# EAGLE design -6V (EAGLE 6.5.0)
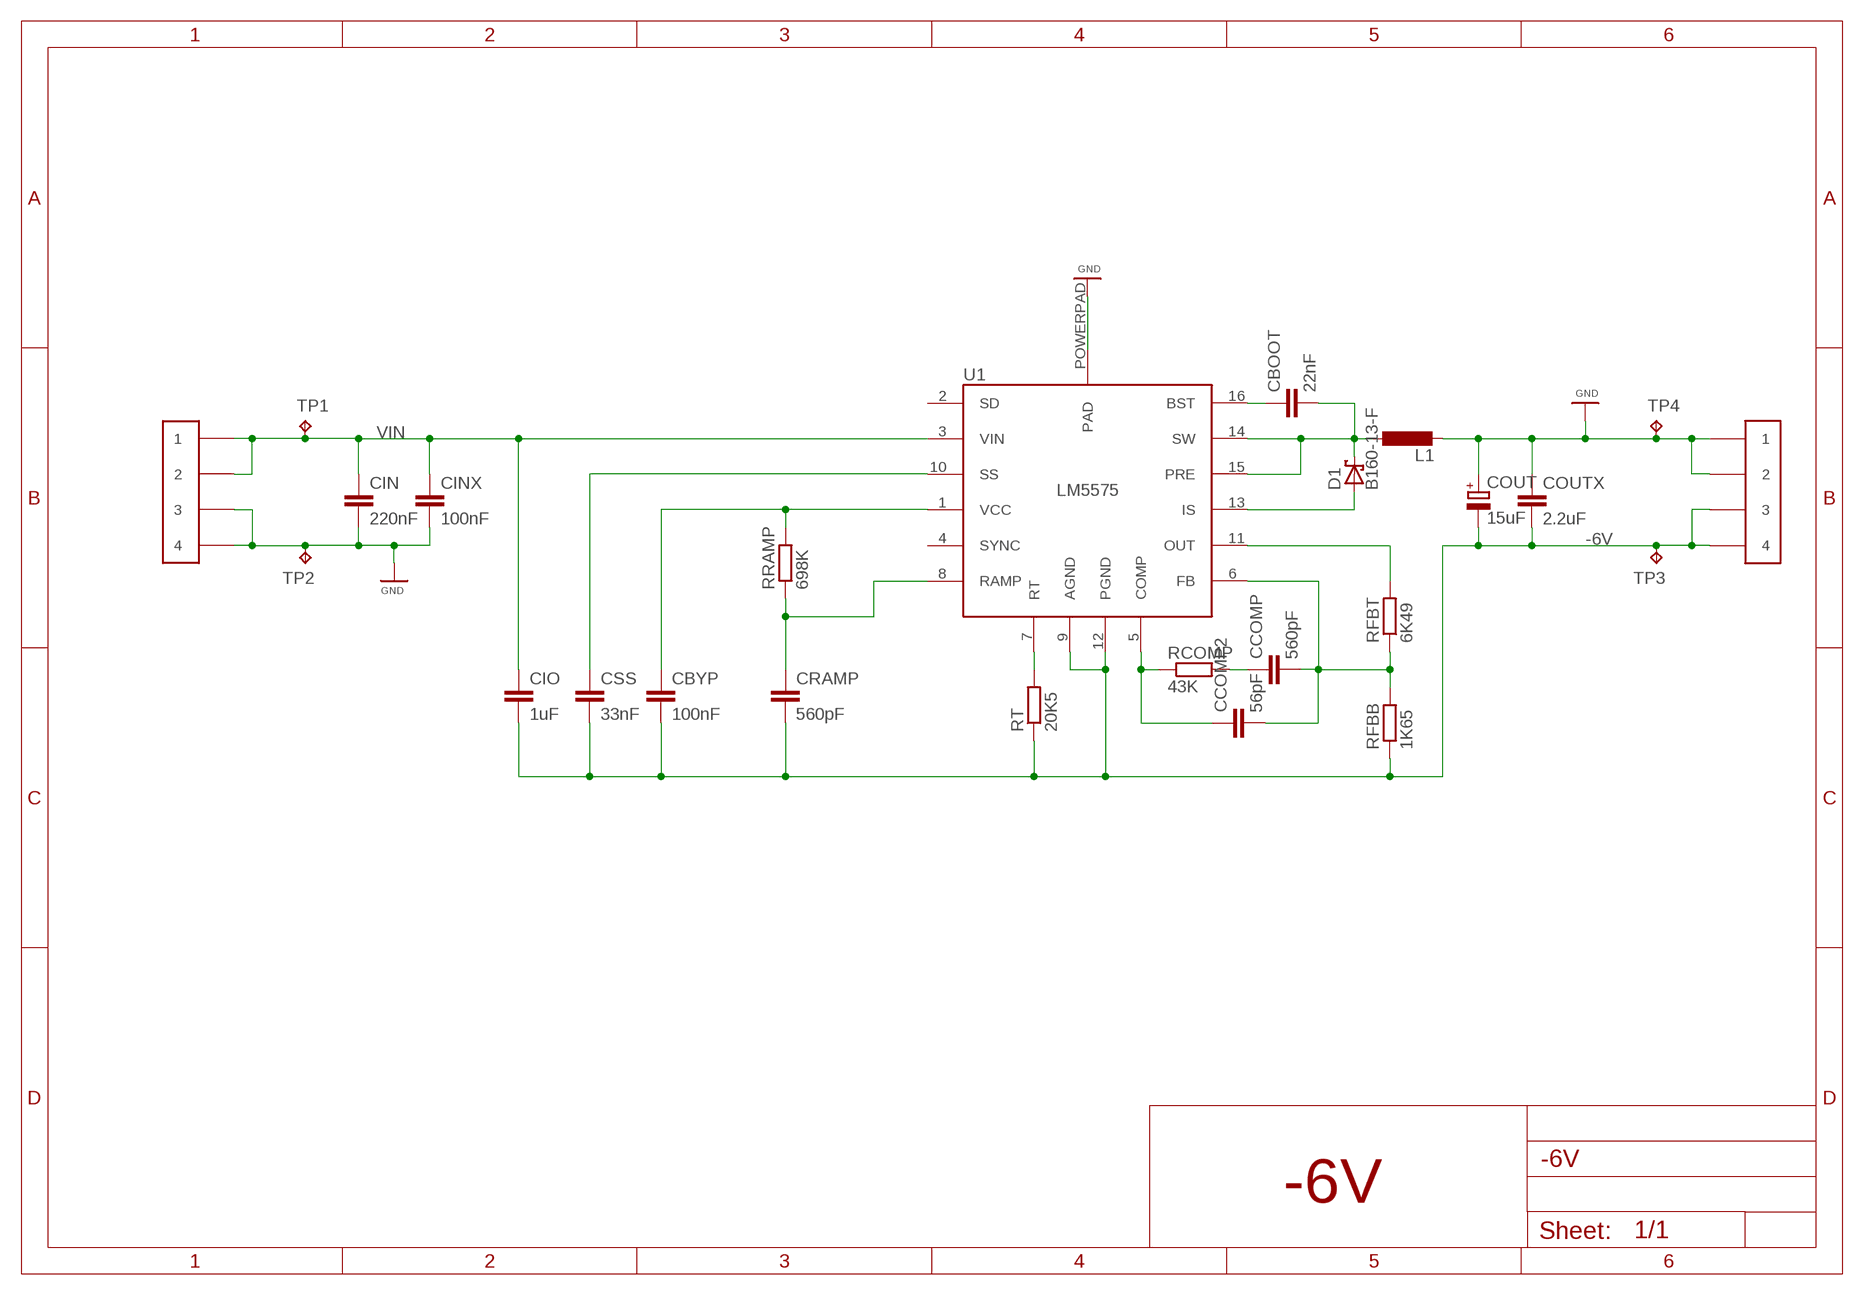
[diagram p0: schematic, sheet 1]
FRAME1 (FRAME): EXCLUDE_FROM_BOM: YES

## Parts
CBOOT  22nF  C0603  [C0603]
CBYP  100nF  C0603  [C0603]
CCOMP  560pF  C0603  [C0603]
CCOMP2  56pF  C0603  [C0603]
CIN  220nF  C0805  [C0805]
CINX  100nF  C0805  [C0805]
CIO  1uF  C1206  [C1206]
COUT  15uF  CPOLKEMET_EDK_5MM  [KEMET_EDK_5MM]
COUTX  2.2uF  C0603  [C0603]
CRAMP  560pF  C0603  [C0603]
CSS  33nF  C0603  [C0603]
D1  B160-13-F  [SMA]
L1  LSDR1006  [BOURNS-SDR1006]
RCOMP  43K  R0603  [R0603]
RFBB  1K65  R0603  [R0603]
RFBT  6K49  R0603  [R0603]
RRAMP  698K  R0603  [R0603]
RT  20K5  R0603  [R0603]
TP1  TP  [TESTPAD]
TP2  TP  [TESTPAD]
TP3  TP  [TESTPAD]
TP4  TP  [TESTPAD]
U1  LM5575  [HTSSOP16]
X1  PINCON-1X4  [PINCON-1X4]
X2  PINCON-1X4  [PINCON-1X4]

## Nets
-6V: CBYP.2 CIO.2 COUT.M(-) COUTX.2 CRAMP.2 CSS.2 RFBB.1 RT.1 TP3.P$1(TP) U1.9(AGND) U1.12(PGND) X2.P$3 X2.P$4
GND: CIN.2 CINX.2 COUT.P(+) COUTX.1 L1.2 TP2.P$1(TP) TP4.P$1(TP) U1.POWERPAD(PAD) X1.P$3 X1.P$4 X2.P$1 X2.P$2
N$2: CSS.1 U1.10(SS)
N$3: CBYP.1 RRAMP.2 U1.1(VCC)
N$4: CRAMP.1 RRAMP.1 U1.8(RAMP)
N$5: RT.2 U1.7(RT)
N$7: CCOMP2.1 RCOMP.1 U1.5(COMP)
N$8: CCOMP.1 RCOMP.2
N$9: CCOMP2.2 CCOMP.2 RFBB.2 RFBT.1 U1.6(FB)
N$10: RFBT.2 U1.11(OUT)
N$11: D1.A U1.13(IS)
N$12: CBOOT.2 D1.C L1.1 U1.14(SW) U1.15(PRE)
N$13: CBOOT.1 U1.16(BST)
VIN: CIN.1 CINX.1 CIO.1 TP1.P$1(TP) U1.3(VIN) X1.P$1 X1.P$2
Unconnected: U1.2(SD) U1.4(SYNC)

## Notes on the sheet
- -6V

## Library data of the parts
CBOOT CBYP CCOMP CCOMP2 CIN CINX CRAMP CSS = plr_rcl:C
CIO = plr_rcl:C; MANUFACTURER: TDK; MPN: C3216X7R1H105K; OC_DIGIKEY: 445-1423-1-ND; OC_FARNELL: 1907358; OC_MOUSER: 810-C3216X7R1H105K
COUT = plr_rcl:CPOL; MANUFACTURER: Panasonic; MPN: 10SVP15M; OC_DIGIKEY: P16431CT-ND; OC_FARNELL: 9188886; OC_MOUSER: 667-10SVP15M
COUTX = plr_rcl:C; MANUFACTURER: Murata; MPN: GRM188R61A225KE34D; OC_DIGIKEY: 490-1545-1-ND; OC_FARNELL: 1828799; OC_MOUSER: 81-GRM188R61A225KE34
D1 = plr_diodes:B160-13-F; MANUFACTURER: DIODES INC; MPN: B160-13-F; OC_DIGIKEY: B160-FDICT-ND; OC_FARNELL: 1843674; OC_MOUSER: 621-B160-F
L1 = plr_rcl:L; MANUFACTURER: Bourns; MPN: SDR1006-560KL; OC_DIGIKEY: SDR1006-560KLCT-ND; OC_FARNELL: 2309276; OC_MOUSER: 652-SDR1006-560KL
RCOMP RFBB RFBT RRAMP RT = plr_rcl:R
TP1-TP4 = plr_common:TP; EXCLUDE_FROM_BOM: YES
U1 = plr_vreg:LM5575; MANUFACTURER: TI; MPN: LM5575MH/NOPB; OC_DIGIKEY: LM5575MH/NOPB-ND; OC_FARNELL: 1325420; OC_MOUSER: 926-LM5575MH/NOPB
X1 X2 = plc_con:PINCON-1X4

## Board
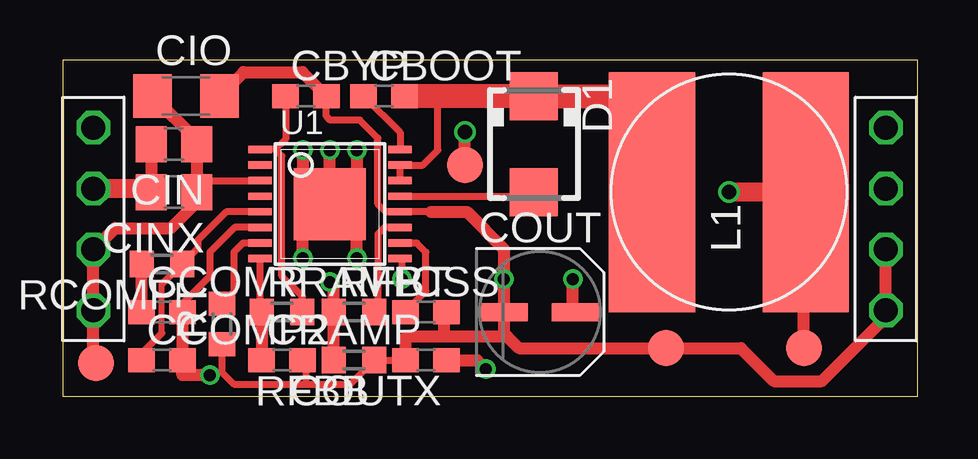
[diagram p1: board, top side]
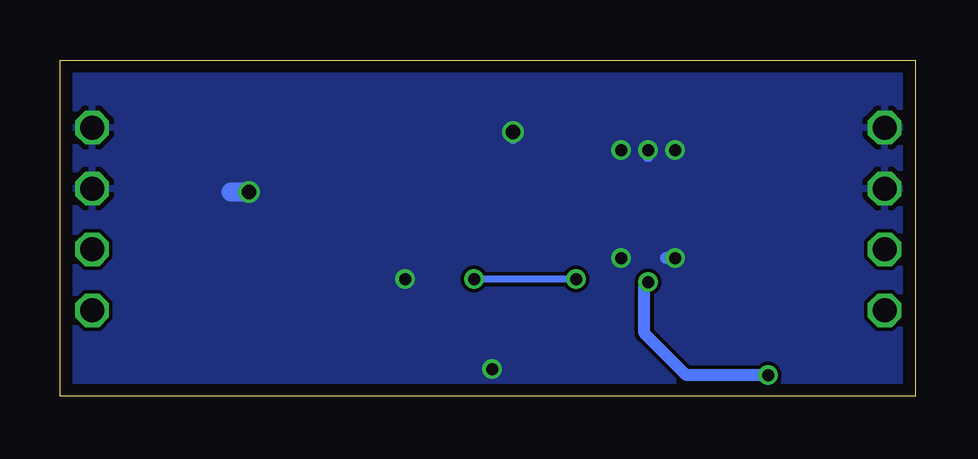
[diagram p2: board, bottom side, seen from below]

Size 35.62 x 14 mm. Coordinates in mm from the lower left corner, seen from the top.
Outline: 0,0 35.62,0 35.62,14 0,14 0,0
Copper layers (1*16): Top 0.035mm / dielectric 1.5mm / Bottom 0.035mm
Design rules "multi-cb_035um-cu_en *": minimum track width 6mil, minimum drill 12mil, track to track 6mil, track to pad 6mil, pad to pad 6mil, via to via 6mil, smd to smd 6mil, copper to edge 20mil, drill to drill 8mil, minimum pad ring 8mil, minimum via ring 6mil, stop-mask expansion 3mil, vias tented up to drill 0mil, thermal gap 8mil

### Footprints (pad centres in the part's own frame; a part is rotated, then mirrored left to right if it is on the bottom)
C0603 = smd 1.1 x 1: 1 -0.85,0; 2 0.85,0
C0805 = smd 1.3 x 1.5: 1 -0.95,0; 2 0.95,0
C1206 = smd 1.6 x 1.8: 1 -1.4,0; 2 1.4,0
KEMET_EDK_5MM = smd 2 x 0.75: M -1.5,0; P 1.5,0
SMA = smd 2 x 2: A 2,0; C -2,0
BOURNS-SDR1006 = smd 10 x 3.6: 1 0,3.2; 2 0,-3.2
R0603 = smd 1 x 1.1: 1 -0.85,0; 2 0.85,0
TESTPAD = smd 1.5 x 1.5: P$1 0,0
HTSSOP16 = smd 0.305 x 0.991: 1 -2.275,-2.918; 2 -1.625,-2.918; 3 -0.975,-2.918; 4 -0.325,-2.918; 5 0.325,-2.918; 6 0.975,-2.918; 7 1.625,-2.918; 8 2.275,-2.918; 9 2.275,2.918; 10 1.625,2.918; 11 0.975,2.918; 12 0.325,2.918; 13 -0.325,2.918; 14 -0.975,2.918; 15 -1.625,2.918; 16 -2.275,2.918 | smd 3 x 3: POWERPAD 0,0
PINCON-1X4 = drill 1 octagon: P$1 -3.81,0; P$2 -1.27,0; P$3 1.27,0; P$4 3.81,0

### Placement (x,y rotation side)
CBOOT  13.38,12.5 0 top
CBYP  10.12,12.5 0 top
CCOMP  4.12,3.5 0 top
CCOMP2  4.12,1.5 0 top
CIN  4.62,10.5 180 top
CINX  4.62,8.5 180 top
CIO  5.12,12.5 0 top
COUT  19.88,3.5 0 top
COUTX  15.12,1.5 180 top
CRAMP  9.12,1.5 0 top
CSS  15.12,3.5 0 top
D1  19.62,10.5 270 top
L1  27.75,8.5 90 top
RCOMP  4.12,5.5 180 top
RFBB  12.12,1.5 180 top
RFBT  12.12,3.5 0 top
RRAMP  9.12,3.5 0 top
RT  6.62,3 90 top
TP1  1.38,1.38 0 top
TP2  16.75,9.62 0 top
TP3  25.12,2 0 top
TP4  30.88,2 0 top
U1  11.12,8 270 top
X1  1.27,7.38 90 top
X2  34.29,7.38 270 top

### Tracks (layer width: path | path; a pad name or v marks a point on that pad's centre or on a via)
-6V  (via drill 0.5)
  Top 0.3: RT.1 6.62,1 7.12,0.5 10.12,0.5 | 10.12,0.5 11.97,0.5 RFBB.1 COUTX.2 | CRAMP.2 10.12,1.35 10.12,0.5 | 14.28,2.44 14.34,2.5 | CBYP.2 10.97,11.65 11.12,11.5 12.38,11.5 13.12,10.75 13.12,8 13.45,7.67 U1.12 15.32,7.67 | CSS.2 15.88,3.6 | U1.9 14.12,5.64 v14.12,4.88
  Top 0.5: COUTX.2 14.28,2.44 | 14.34,2.5 15.88,2.5 | CIO.2 7.53,13.5 9.97,13.5 CBYP.2 | 15.88,3.6 15.88,2.5 | COUT.M 18.5,3.5 | COUT.M v18.38,4.88 18.38,6.12 16.82,7.67 15.32,7.67 | 15.88,2.5 18.5,2.5 | 18.5,2.5 19,2 TP3.P$1 28.25,2 29.62,0.62 31.62,0.62 34.29,3.29 X2.P$4 X2.P$3 | COUT.M 18.38,2.62 18.5,2.5
  Bottom 0.3: v14.12,4.88 v18.38,4.88
GND  (via drill 0.5, 0.6)
  Top 0.5: CIN.2 CINX.2 | U1.POWERPAD 11.12,9.25 | COUTX.1 17.25,1.5 v17.62,1.12 | COUT.P 21.25,3.62 v21.25,4.88 | v10,5.75 10,6.88 U1.POWERPAD | v12.25,5.75 12.25,6.88 U1.POWERPAD | v12.25,10.25 12.25,9.12 U1.POWERPAD | v10,10.25 10,9.12 U1.POWERPAD | U1.POWERPAD v11.12,10.25 | TP4.P$1 30.88,8.43 L1.2 | TP2.P$1 v16.75,11
  Top 0.8: L1.2 v27.75,8.5 | CINX.2 3.53,8.64 X1.P$3
  Bottom 0.5: v10,5.75 10.38,5.75 | v17.62,1.12 17.5,1.25 | v21.25,4.88 21.25,4.75 | v11.12,10.25 11.12,10 | v16.75,11 16.75,10.75
  Bottom 0.8: v27.75,8.5 28.5,8.5
  pour Bottom: -1,17 41,17 41,-1 -1,-1
N$2
  Top 0.3: CSS.1 14.28,3.52 15.12,4.38 15.12,6 14.75,6.38 U1.10
N$3
  Top 0.3: RRAMP.2 9.97,4.15 9.12,5 9.12,10 8.85,10.28 | 8.85,10.28 U1.1 | CBYP.1 9.28,10.7 8.85,10.28
N$4
  Top 0.3: U1.8 8.21,3.57 RRAMP.1
  Top 0.5: RRAMP.1 CRAMP.1
N$5
  Top 0.3: U1.7 7.5,6.38 7.12,6 7.12,4.35 RT.2
N$7
  Top 0.25: 4.12,2.62 4.12,4.65
  Top 0.3: U1.5 6.8,7.67 5.62,6.5 5.62,6.15 RCOMP.1 4.12,4.65 | CCOMP2.1 3.27,1.77 4.12,2.62
N$8
  Top 0.5: CCOMP.1 RCOMP.2
N$9  (via drill 0.5)
  Top 0.3: U1.6 7.15,7.03 6.12,6 6.12,5 4.97,3.85 CCOMP.2
  Top 0.5: CCOMP.2 CCOMP2.2 | RFBB.2 RFBT.1 11.28,4.6 v11.12,4.75 | CCOMP2.2 4.97,0.9 | v6.12,0.88 4.97,0.88 CCOMP2.2
  Bottom 0.5: v6.12,0.88 9.53,0.88 11.28,2.62 11.28,4.6 v11.12,4.75
N$10
  Top 0.3: U1.11 13.4,7.03 13.12,6.75 13.12,3.65 RFBT.2
N$11
  Top 0.3: U1.13 19.45,8.32 D1.A
N$12
  Top 0.3: U1.14 U1.15 15,9.62 15.62,10.25 15.62,12.5
  Top 1: CBOOT.2 15.62,12.5 D1.C 24.55,12.5 L1.1
N$13
  Top 0.3: U1.16 14.04,10.98 CBOOT.1
VIN
  Top 0.3: CINX.1 6.05,8.97 U1.3
  Top 0.5: CIO.1 5.58,10.65 CIN.1 CINX.1 5.58,8.07 4.5,7 2.17,7 X1.P$2 X1.P$1 1.27,1.38 TP1.P$1